# Altium schematic sheet Reference-L.SchDoc
size A4; SheetNumber: 0; SheetTotal: 0
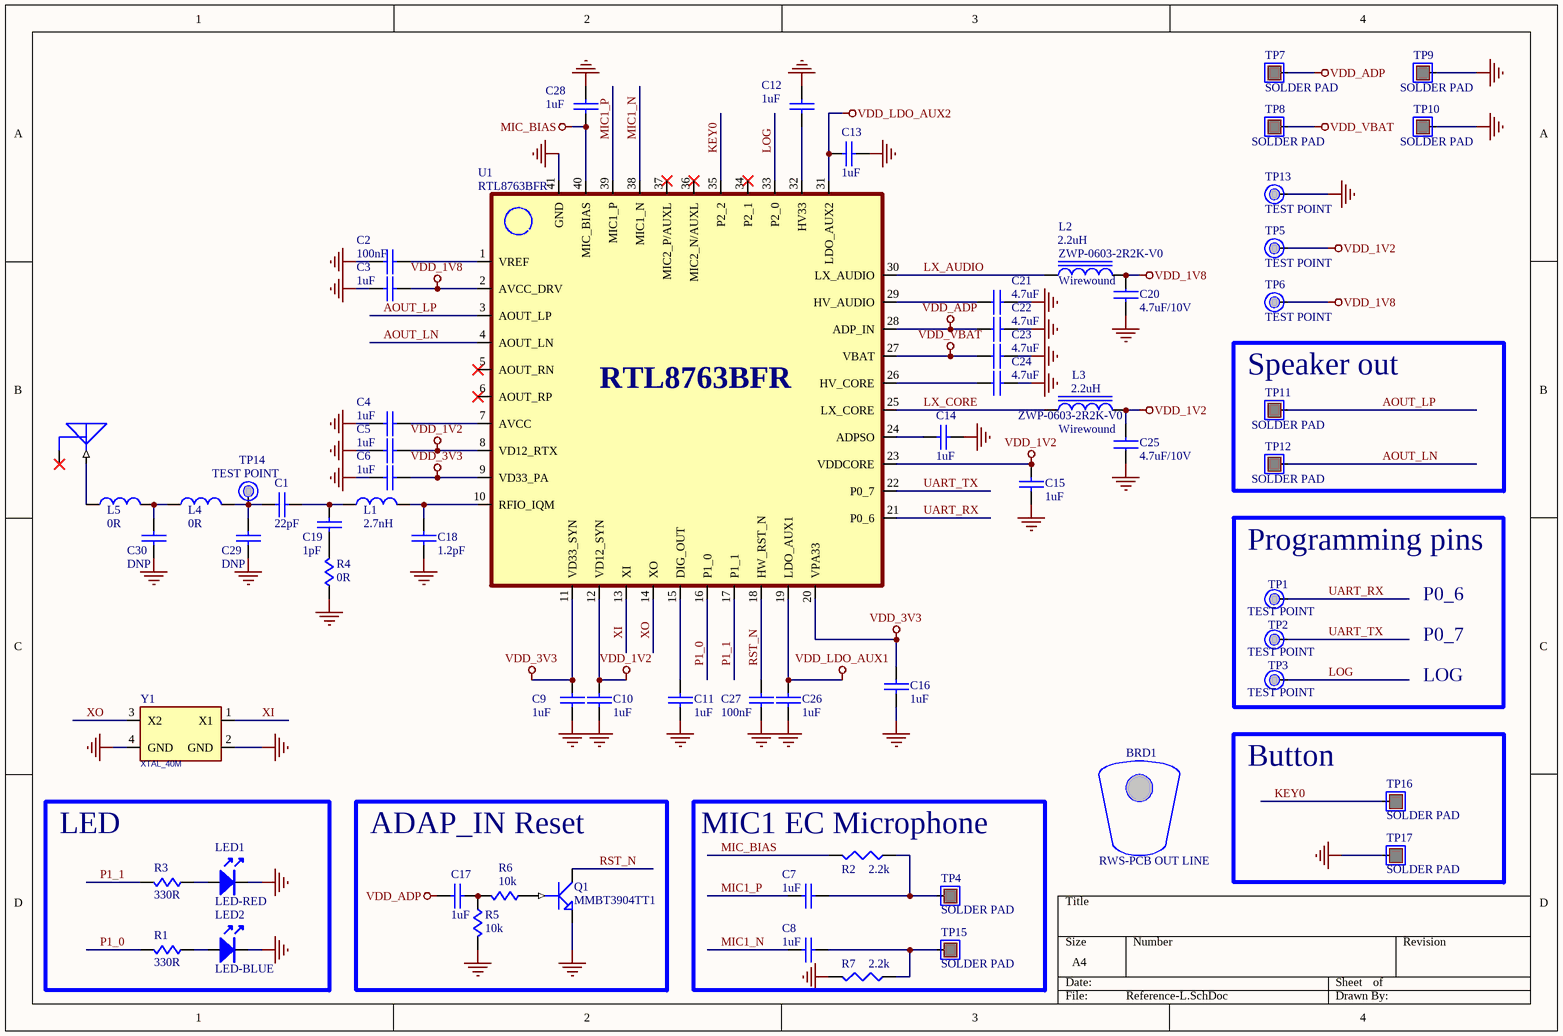
[diagram p0: Reference-L.SchDoc]

## Parts
ANT1  ANTENNA-2  [ANT-ACX-AT8010]  (value not drawn)
BRD1  RWS-PCB OUT LINE  [BOARD-L]
C1  22pF  [CAP_0201]
C2  100nF  [CAP_0201]
C3  1uF  [CAP_0201]
C4  1uF  [CAP_0201]
C5  1uF  [CAP_0201]
C6  1uF  [CAP_0201]
C7  1uF  [CAP_0201]
C8  1uF  [CAP_0201]
C9  1uF  [CAP_0201]
C10  1uF  [CAP_0201]
C11  1uF  [CAP_0201]
C12  1uF  [CAP_0201]
C13  1uF  [CAP_0201]
C14  1uF  [CAP_0201]
C15  1uF  [CAP_0201]
C16  1uF  [CAP_0201]
C17  1uF  [CAP_0201]
C18  1.2pF  [CAP_0201]
C19  1pF  [CAP_0201]
C20  4.7uF/10V  [CAP_0402]
C21  4.7uF  [CAP_0402]
C22  4.7uF  [CAP_0402]
C23  4.7uF  [CAP_0402]
C24  4.7uF  [CAP_0402]
C25  4.7uF/10V  [CAP_0402]
C26  1uF  [CAP_0201]
C27  100nF  [CAP_0201]
C28  1uF  [CAP_0201]
C29  DNP  [CAP_0201]
C30  DNP  [CAP_0201]
L1  2.7nH  [IND_0201]
L2  2.2uH  [IND_0603]
L3  2.2uH  [IND_0603]
L4  0R  [IND_0201]
L5  0R  [IND_0201]
LED1  LED-RED  [LED-0603]
LED2  LED-BLUE  [LED-0603]
Q1  MMBT3904TT1  [SOT323]
R1  330R  [RES_0201]
R2  2.2k  [0201]
R3  330R  [RES_0201]
R4  0R  [RES_0201]
R5  10k  [RES_0201]
R6  10k  [RES_0201]
R7  2.2k  [0201]
TP1  TEST POINT  [TP-0.8MM]
TP2  TEST POINT  [TP-0.8MM]
TP3  TEST POINT  [TP-0.8MM]
TP4  SOLDER PAD  [TP-SOLDER]
TP5  TEST POINT  [TP-0.8MM]
TP6  TEST POINT  [TP-0.8MM]
TP7  SOLDER PAD  [TP-SOLDER-SQ]
TP8  SOLDER PAD  [TP-SOLDER-SQ]
TP9  SOLDER PAD  [TP-SOLDER]
TP10  SOLDER PAD  [TP-SOLDER]
TP11  SOLDER PAD  [TP-SOLDER]
TP12  SOLDER PAD  [TP-SOLDER]
TP13  TEST POINT  [TP-0.8MM]
TP14  TEST POINT  [TP-0.8MM]
TP15  SOLDER PAD  [TP-SOLDER]
TP16  SOLDER PAD  [TP-SOLDER-SQ]
TP17  SOLDER PAD  [TP-SOLDER-SQ]
U1  RTL8763BFR  [QFN40-0.4-5X5]
Y1  XTAL_40M  [CRY_2.5X2.0]

## Blocks framed on the sheet
Speaker out: TP11 TP12
Programming pins: TP1-TP3
Button: TP16 TP17
LED: LED1 LED2 R1 R3
ADAP_IN Reset: C17 Q1 R5 R6
MIC1 EC Microphone: C7 C8 R2 R7 TP4 TP15

## Nets
GND: C2.2 C3.2 C4.2 C5.2 C6.2 C9.2 C10.2 C11.2 C12.2 C13.2 C14.2 C15.2 C16.2 C18.2 C20.2 C21.2 C22.2 C23.2 C24.2 C25.1 C26.2 C27.2 C28.2 C29.2 C30.2 LED1.2(K) LED2.2(K) Q1.2(E) R4.1 R5.2 R7.2 TP9.1 TP10.1 TP13.1 TP17.1 U1.41(GND) Y1.2(GND) Y1.4(GND)
MIC_BIAS: C28.1 R2.2 U1.40(MIC_BIAS)
VDD_1V2: C5.1 C10.1 C15.1 C25.2 L3.2 TP5.1 U1.8(VD12_RTX) U1.12(VD12_SYN) U1.23(VDDCORE)
VDD_1V8: C3.1 C20.1 L2.2 TP6.1 U1.2(AVCC_DRV)
VDD_3V3: C6.1 C9.1 C16.1 U1.9(VD33_PA) U1.11(VD33_SYN) U1.20(VPA33)
VDD_ADP: C17.2 C22.1 TP7.1 U1.28(ADP_IN)
VDD_LDO_AUX1: C26.1 U1.19(LDO_AUX1)
VDD_LDO_AUX2: C13.1 U1.31(LDO_AUX2)
VDD_VBAT: C23.1 TP8.1 U1.27(VBAT)
AOUT_LN: TP12.1 U1.4(AOUT_LN)
AOUT_LP: TP11.1 U1.3(AOUT_LP)
KEY0: TP16.1 U1.35(P2_2)
LOG: TP3.1 U1.33(P2_0)
LX_AUDIO: L2.1 U1.30(LX_AUDIO)
LX_CORE: L3.1 U1.25(LX_CORE)
MIC1_N: C8.1 U1.38(MIC1_N)
MIC1_P: C7.1 U1.39(MIC1_P)
P1_0: R1.2 U1.16(P1_0)
P1_1: R3.2 U1.17(P1_1)
RST_N: C27.1 Q1.3(C) U1.18(HW_RST_N)
UART_RX: TP1.1 U1.21(P0_6)
UART_TX: TP2.1 U1.22(P0_7)
XI: U1.13(XI) Y1.1(X1)
XO: U1.14(XO) Y1.3(X2)
NetANT1_1: ANT1.1(FEED) L5.1
NetC1_1: C1.1 C29.1 L4.2 TP14.1
NetC1_2: C1.2 C19.1 L1.1
NetC2_1: C2.1 U1.1(VREF)
NetC4_1: C4.1 U1.7(AVCC)
NetC7_2: C7.2 R2.1 TP4.1
NetC8_2: C8.2 R7.1 TP15.1
NetC11_1: C11.1 U1.15(DIG_OUT)
NetC12_1: C12.1 U1.32(HV33)
NetC14_1: C14.1 U1.24(ADPSO)
NetC17_1: C17.1 R5.1 R6.2
NetC18_1: C18.1 L1.2 U1.10(RFIO_IQM)
NetC19_2: C19.2 R4.2
NetC21_1: C21.1 U1.29(HV_AUDIO)
NetC24_1: C24.1 U1.26(HV_CORE)
NetC30_1: C30.1 L4.1 L5.2
NetLED1_1: LED1.1(A) R3.1
NetLED2_1: LED2.1(A) R1.1
NetQ1_1: Q1.1(B) R6.1

Not connected (* = marked no-connect by the designer): ANT1 2(GND)*; U1 5(AOUT_RN)* 6(AOUT_RP)* 34(P2_1)* 36(MIC2_N/AUXL)* 37(MIC2_P/AUXL)*

## Notes on the sheet
- (near L2) ZWP-0603-2R2K-V0
- (near L2) Wirewound
- (near L3) ZWP-0603-2R2K-V0
- Wirewound
- P0_6
- P0_7
- LOG

## Library data of the parts
ANT1 = ANTENNA-2_4
C1-C19 C26-C30 = CAP: Capacitor
C20-C25 = 4.7uF: CHIP CAP 4.7uF 6.3V K 0603  X5R; Part Number: CC0603ZRY5V5BB475; QVL: CTC(國巨); Tolerance: +80-20％; Character: Y5V; Capacitance: 4.7uF; Size: 0603; Voltage: 6.3V
L1 L4 L5 = INDUCTOR-MINI
L2 L3 = INDUCTOR IRON
LED1 LED2 = LED
Q1 = NPN
R1 R3-R6 = RESISTANCE
R2 R7 = 1.5K: CHIP RES 1.5K 1/16W 0402; Part Number: RC0402FR-071K5L; Tolerance: ±5％; QVL: CTC(國巨); Resistance: 1.5K; Size: 0402; Power rating@70℃: 1/16W
TP4 TP7-TP12 TP15-TP17 = TEST POINT-SQ
U1 = RTL8763
Y1 = XTAL: S2520A-040000-T12-BBK-1AHA(YOKE); Part Number: 40M xtal 2.5x2.0